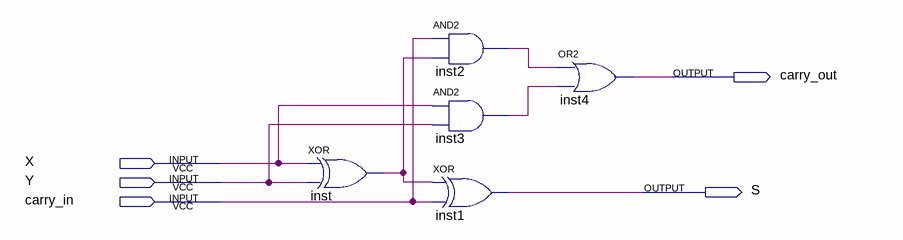
[diagram p0: schematic sheet]
// Quartus schematic full-adder.bdf as structural Verilog: 5 symbols, 5 pins
module \full-adder  (
  input  X,
  input  Y,
  input  carry_in,
  output carry_out,
  output S
);

  wire inst2_out, inst3_out, inst_out;

  xor inst (inst_out, X, Y);
  and inst2 (inst2_out, carry_in, inst_out);
  and inst3 (inst3_out, X, Y);
  xor inst1 (S, inst_out, carry_in);
  or inst4 (carry_out, inst2_out, inst3_out);
endmodule
